# EAGLE design 5v-low-power (EAGLE 6.5.0)
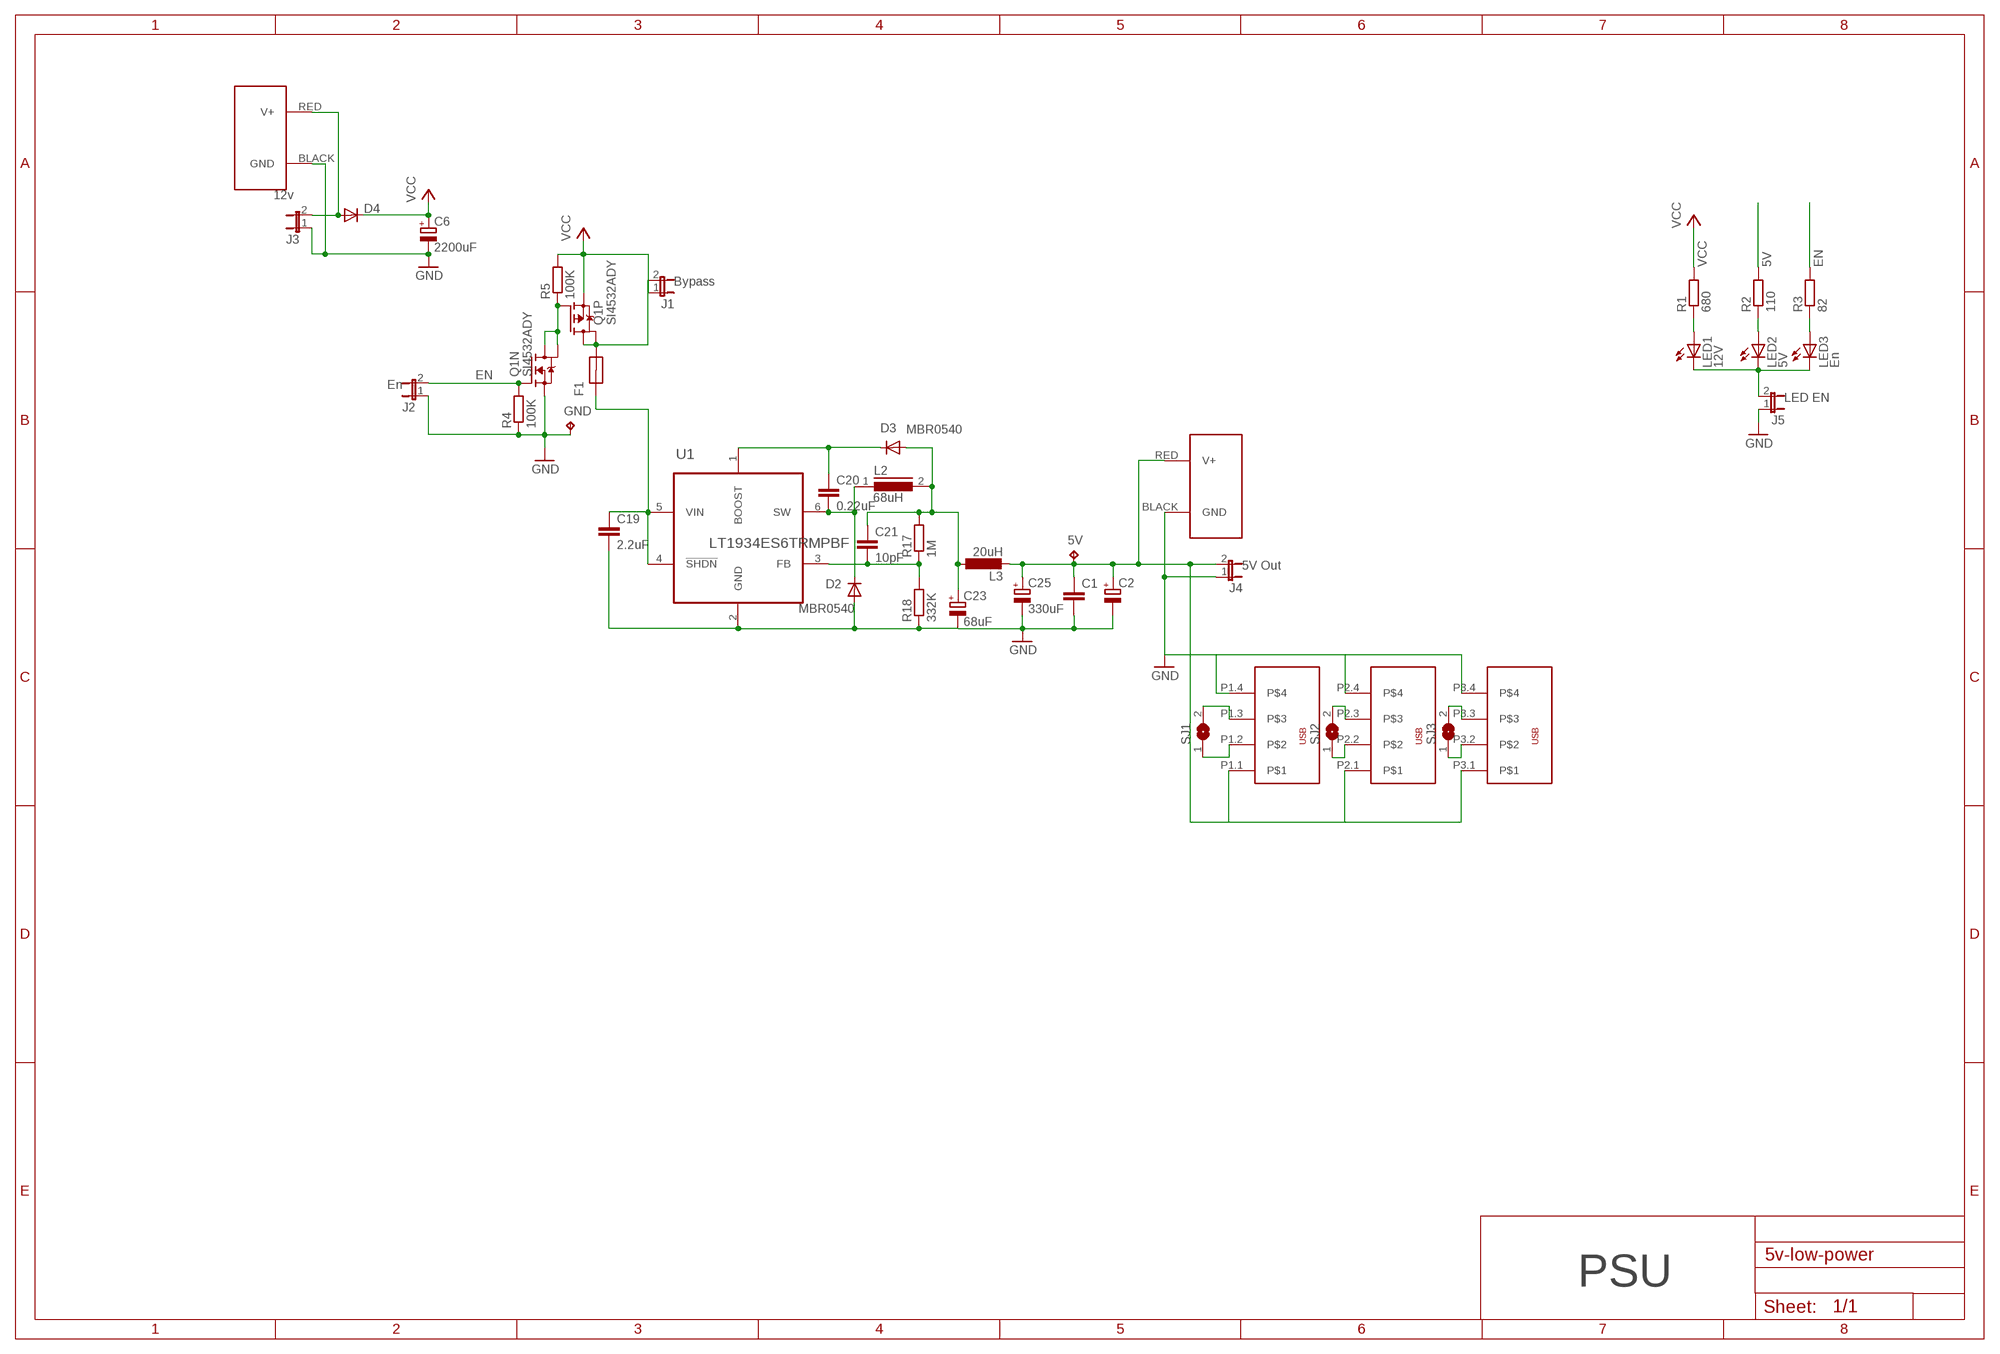
[diagram p0: schematic, sheet 1]

## Parts
5V  5V B  TPB1,27  [B1,27]
C1  C-EUC0805  [C0805]
C2  CPOL-EUB/3528-21R  [B/3528-21R]
C6  2200uF  CPOL-EUE5-13  [E5-13]
C19  2.2uF  C-EUC0805  [C0805]
C20  0.22uF  C-EUC0805  [C0805]
C21  10pF  C-EUC0805  [C0805]
C23  68uF  CPOL-EUE  [PANASONIC_E]
C25  330uF  CPOL-EUE5-8.5  [E5-8,5]
D2  MBR0540  MBR0520LT  [SOD123]
D3  MBR0540  MBR0520LT  [SOD123]
D4  DIODE-SMB  [SMB]
F1  MF-MSMF110  [1812]
GND  5V B  TPB1,27  [B1,27]
J1  Bypass  2-PIN-MOLEX  [2-MOLEX]
J2  En  2-PIN-MOLEX  [2-MOLEX]
J3  12v  2-PIN-MOLEX  [2-MOLEX]
J4  5V Out  2-PIN-MOLEX  [2-MOLEX]
J5  LED EN  2-PIN-MOLEX  [2-MOLEX]
J6  POWERPOLE_POWER25A  [POWERPOLE_PAIR_25A]
J7  POWERPOLE_POWER25A  [POWERPOLE_PAIR_25A]
L2  68uH  DR127  [DR127]
L3  20uH  L-EU6000-XXX-RC  [6000-XXXX-RC]
LED1  12V  LEDCHIP-LED0805  [CHIP-LED0805]
LED2  5V  LEDCHIP-LED0805  [CHIP-LED0805]
LED3  En  LEDCHIP-LED0805  [CHIP-LED0805]
Q1  SI4532ADY  [SO8]
R1  680  R-EU_R0805  [R0805]
R2  110  R-EU_R0805  [R0805]
R3  82  R-EU_R0805  [R0805]
R4  100K  R-EU_R0805  [R0805]
R5  100K  R-EU_R0805  [R0805]
R17  1M  R-EU_R0805  [R0805]
R18  332K  R-EU_R0805  [R0805]
SJ1  SJ  [SJ]
SJ2  SJ  [SJ]
SJ3  SJ  [SJ]
U1  LT1934ES6TRMPBF  [SOT95P280X100-6N]
U$1  USB_DUAL_VERT+HORIZTRIPPLE  [USB_DUAL_HORIZ+VERT]

## Nets
5V: 5V.TP C1.1 C2.+ C25.+ J4.2 J6.RED(V+) L3.2 R2.2 U$1.P1.1 U$1.P2.1 U$1.P3.1
EN: J2.2 Q1.2(N:G) R3.2 R4.2
GND: C1.2 C2.- C6.- C19.2 C23.- C25.- D2.A GND.TP J2.1 J3.1 J4.1 J5.1 J6.BLACK(GND) J7.BLACK(GND) Q1.1(N:S) R4.1 R18.1 U1.2(GND) U$1.P1.4 U$1.P2.4 U$1.P3.4
LEDGND1: J5.2 LED1.C LED2.C LED3.C
N$1: LED1.A R1.1
N$2: SJ1.2 U$1.P1.3
N$3: D4.A J3.2 J7.RED(V+)
N$4: SJ1.1 U$1.P1.2
N$5: SJ2.1 U$1.P2.2
N$6: SJ2.2 U$1.P2.3
N$7: SJ3.2 U$1.P3.3
N$8: SJ3.1 U$1.P3.2
N$25: Q1.4(P:G) Q1.7(N:D) Q1.8(N:D) R5.1
N$47: LED2.A R2.1
N$74: LED3.A R3.1
N$78: C20.2 D2.C L2.1 U1.6(SW)
N$95: F1.2 J1.2 Q1.5(P:D) Q1.6(P:D)
N$107: C21.1 C23.+ D3.A L2.2 L3.1 R17.2
N$117: C20.1 D3.C U1.1(BOOST)
N$118: C21.2 R17.1 R18.2 U1.3(FB)
VCC: C6.+ D4.C J1.1 Q1.3(P:S) R1.2 R5.2
VCC_HP2_SW: C19.1 F1.1 U1.4(!SHDN) U1.5(VIN)

## Notes on the sheet
- PSU

## Library data of the parts
5V GND = testpad:TP: Test pad
C1 C19-C21 = resistor:C-EU: CAPACITOR, European symbol
C2 = resistor:CPOL-EU: POLARIZED CAPACITOR, European symbol
C6 C23 C25 = rcl:CPOL-EU: POLARIZED CAPACITOR, European symbol
D2 D3 = diode:MBR0520LT: SCHOTTKY BARRIER RECTIFIER Source: http://onsemi.com .. MBR0520LT1-D.pdf
D4 = diode:DIODE-: DIODE
F1 = farnell-parts:MF-MSMF110
J1-J5 = farnell-parts:2-PIN-MOLEX
J6 J7 = powerpoles:POWERPOLE_POWER: Anderson Powerpole Power Connector using ameteur radio standard layout
L2 = inductors:DR127: High Power Density, High Efficiency, Shielded Inductors Source: coiltronics_dr_series.pdf
L3 = rcl:L-EU: INDUCTOR, European symbol
LED1-LED3 = led:LED: LED OSRAM: - CHIPLED LG R971, LG N971, LY N971, LG Q971, LY Q971, LO R971, LY R971 LH N974, LH R974 LS Q976, LO Q976, LY Q976 LO Q996 - Hyper CHIPLED LW Q18S LB Q993, LB Q99A, LB R99A - SideLED LS A670, LO A670, LY A670, LG A670, LP A670 LB A673, LV A673, LT A673, LW A673 LH A674 LY A675 LS A676, LA A676, LO A676, LY A676, LW A676 LS A679, LY A679, LG A679 - Hyper Micro SIDELED® LS Y876, LA Y876, LO Y876, LY Y876 LT Y87S - SmartLED LW L88C, LW L88S LB L89C, LB L89S, LG L890 LS L89K, LO L89K, LY L89K LS L896, LA L896, LO L896, LY L896 - TOPLED LS T670, LO T670, LY T670, LG T670, LP T670 LSG T670, LSP T670, LSY T670, LOP T670, LYG T670 LG T671, LOG T671, LSG T671 LB T673, LV T673, LT T673, LW T673 LH T674 LS T676, LA T676, LO T676, LY T676, LB T676, LH T676, LSB T676, LW T676 LB T67C, LV T67C, LT T67C, LS T67K, LO T67K, LY T67K, LW E67C LS E67B, LA E67B, LO E67B, LY E67B, LB E67C, LV E67C, LT E67C LW T67C LS T679, LY T679, LG T679 LS T770, LO T770, LY T770, LG T770, LP T770 LB T773, LV T773, LT T773, LW T773 LH T774 LS E675, LA E675, LY E675, LS T675 LS T776, LA T776, LO T776, LY T776, LB T776 LHGB T686 LT T68C, LB T68C - Hyper Mini TOPLED® LB M676 - Mini TOPLED Santana® LG M470 LS M47K, LO M47K, LY M47K Source: http://www.osram.convergy.de LUXEON: - LUMILED® LXK2-PW12-R00, LXK2-PW12-S00, LXK2-PW14-U00, LXK2-PW14-V00 LXK2-PM12-R00, LXK2-PM12-S00, LXK2-PM14-U00 LXK2-PE12-Q00, LXK2-PE12-R00, LXK2-PE12-S00, LXK2-PE14-T00, LXK2-PE14-U00 LXK2-PB12-K00, LXK2-PB12-L00, LXK2-PB12-M00, LXK2-PB14-N00, LXK2-PB14-P00, LXK2-PB14-Q00 LXK2-PR12-L00, LXK2-PR12-M00, LXK2-PR14-Q00, LXK2-PR14-R00 LXK2-PD12-Q00, LXK2-PD12-R00, LXK2-PD12-S00 LXK2-PH12-R00, LXK2-PH12-S00 LXK2-PL12-P00, LXK2-PL12-Q00, LXK2-PL12-R00 Source: www.luxeon.com KINGBRIGHT: KA-3528ASYC Source: www.kingbright.com
Q1 = basestation:SI4532ADY: N and P MOSFETS
R1-R5 R17 R18 = resistor:R-EU_: RESISTOR, European symbol
SJ1-SJ3 = jumper:SJ: SMD solder JUMPER
U1 = farnell-parts:LT1934ES6TRMPBF; DESCRIPTION: Micropower Step-Down Switching Regulators; MPN: LT1934ES6#TRMPBF; OC_FARNELL: 1663810; OC_NEWARK: 59M8316; PACKAGE: TSOT-23-6; SUPPLIER: Linear Technology
U$1 = power:USB_DUAL_VERT+HORIZ

## Board
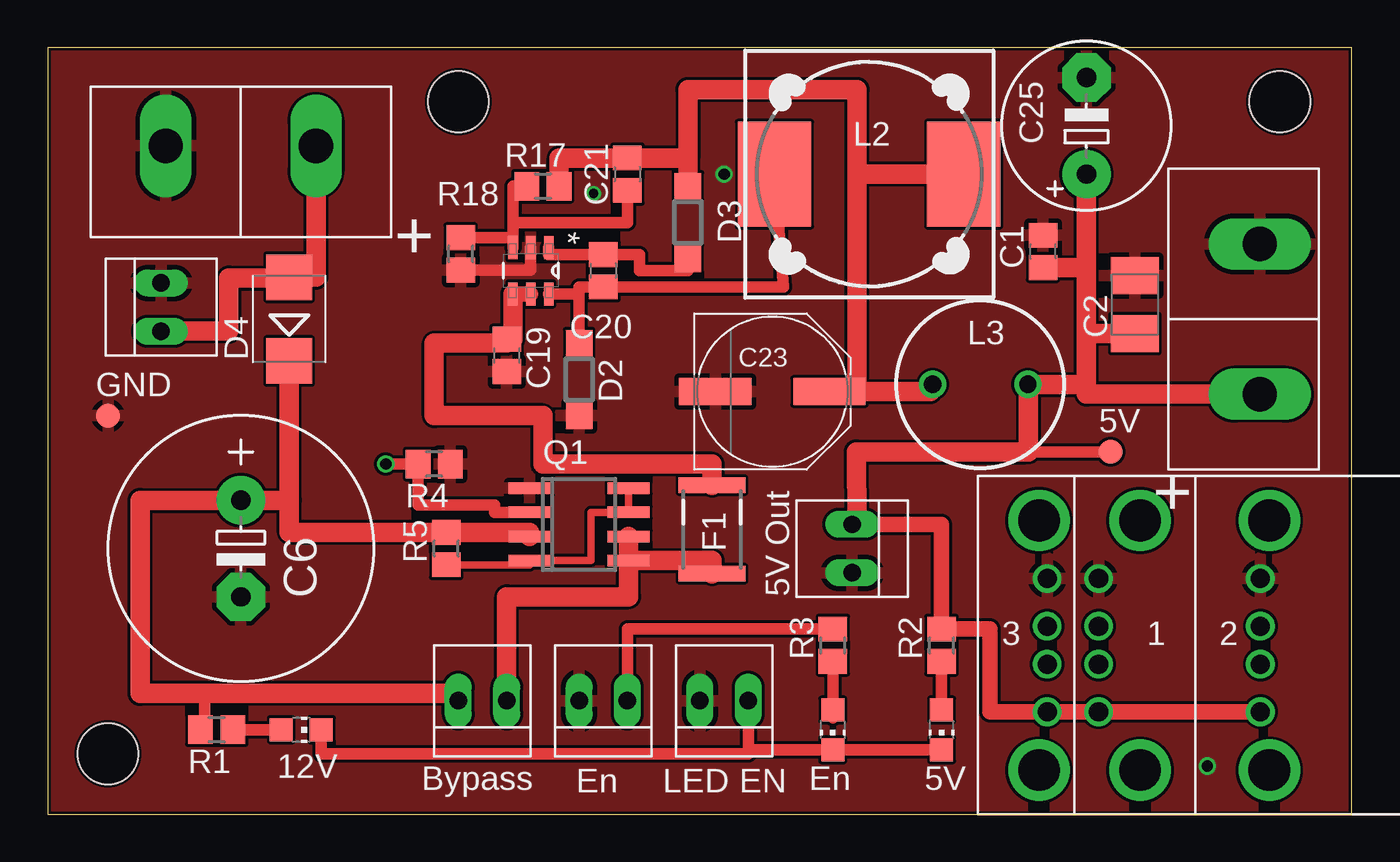
[diagram p1: board, top side]
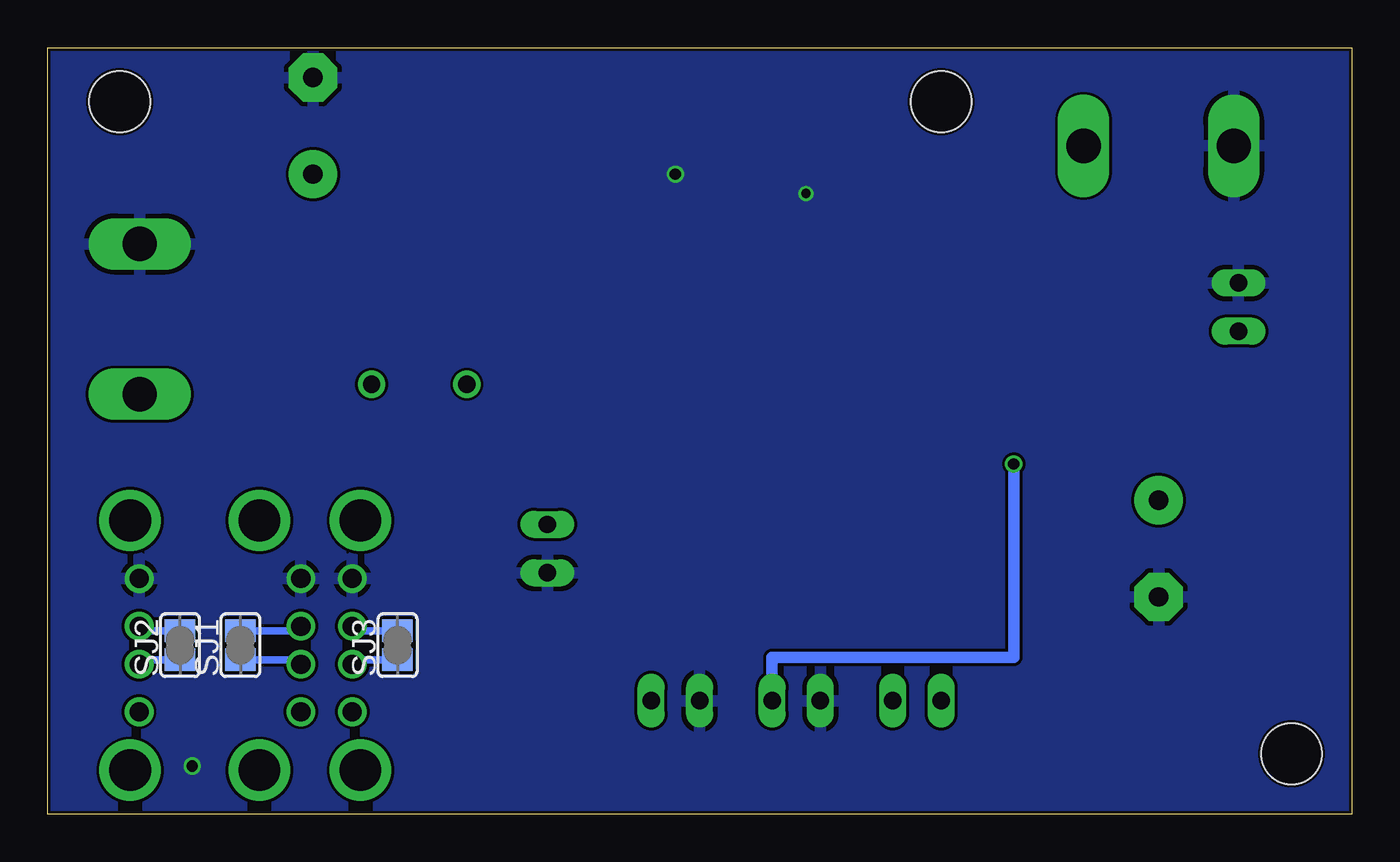
[diagram p2: board, bottom side, seen from below]

Size 68.56 x 40.31 mm. Coordinates in mm from the lower left corner, seen from the top.
Outline: 0,0 68.56,0 68.56,40.31 0,40.31 0,0
Copper layers (1*16): Top 0.035mm / dielectric 1.5mm / Bottom 0.035mm
Design rules "Hackvana *": minimum track width 6mil, minimum drill 0.3mm, track to track 6mil, track to pad 6mil, pad to pad 6mil, via to via 6mil, smd to smd 0mil, copper to edge 6mil, drill to drill 6mil, minimum pad ring 10mil, minimum via ring 6mil, stop-mask expansion 2mil, vias tented up to drill 100mil, thermal gap 10mil
Holes 3.2 mm at 64.77,37.47 21.59,37.47 3.17,3.17

### Footprints (pad centres in the part's own frame; a part is rotated, then mirrored left to right if it is on the bottom)
B1,27 = smd 1.27 x 1.27: TP 0,0
C0805 = smd 1.3 x 1.5: 1 -0.85,0; 2 0.85,0
B/3528-21R = smd 1.95 x 2.5: + 1.525,0; - -1.525,0
E5-13 = drill 1.016 pad 2.54: + -2.54,0 | drill 1.016 pad 2.54 octagon: - 2.54,0
PANASONIC_E = smd 3.8 x 1.4: + 3,0; - -3,0
E5-8,5 = drill 1.016 pad 2.54: + -2.54,0 | drill 1.016 pad 2.54 octagon: - 2.54,0
SOD123 = smd 1.4 x 1.4: A 1.9,0; C -1.9,0
SMB = smd 2.4 x 2.4: A 2.2,0; C -2.2,0
1812 = smd 0.8 x 3.5: 1 -1.425,0; 2 3.225,0
2-MOLEX = drill 0.914 long: 1 -1.27,-0.381; 2 1.27,-0.381
POWERPOLE_PAIR_25A = drill 1.8 long: BLACK 3.95,-0.85; RED -3.95,-0.85
DR127 = smd 3.85 x 5.5: 1 -4.975,0; 2 4.975,0
6000-XXXX-RC = drill 0.9 pad 1.422: 1 -2.5,0; 2 2.5,0
CHIP-LED0805 = smd 1.2 x 1.2: A 0,-1.05; C 0,1.05
SO8 = smd 0.6 x 2.2: 1 -1.905,-2.6; 2 -0.635,-2.6; 3 0.635,-2.6; 4 1.905,-2.6; 5 1.905,2.6; 6 0.635,2.6; 7 -0.635,2.6; 8 -1.905,2.6
R0805 = smd 1.3 x 1.5: 1 -0.85,0; 2 0.85,0
SJ = smd 1.168 x 1.6: 1 -0.762,0; 2 0.762,0
SOT95P280X100-6N = smd 1.219 x 0.508: 1 -1.219,0.94; 2 -1.219,0; 3 -1.219,-0.94; 4 1.219,-0.94; 5 1.219,0; 6 1.219,0.94
USB_DUAL_HORIZ+VERT = drill 2.2: G1.1 2.18,-6.565; G1.2 2.18,6.565; G2.1 8.98,-6.565; G2.2 8.98,6.565; G3.1 -3.13,-6.565; G3.2 -3.13,6.565 | drill 1: P1.1 0,-3.5; P1.2 0,-1; P1.3 0,1; P1.4 0,3.5; P2.1 8.5,-3.5; P2.2 8.5,-1; P2.3 8.5,1; P2.4 8.5,3.5; P3.1 -2.7,-3.5; P3.2 -2.7,-1; P3.3 -2.7,1; P3.4 -2.7,3.5

### Placement (x,y rotation side)
5V  55.88,19.05 0 top
C1  52.32,29.59 90 top
C2  57.15,26.8 270 top
C6  10.16,13.97 270 top
C19  24.13,24.13 270 top
C20  29.21,28.57 270 top
C21  30.48,33.66 270 top
C23  38.1,22.23 0 top
C25  54.61,36.2 90 top
D2  27.94,22.86 270 top
D3  33.66,31.11 90 top
D4  12.7,26.04 90 top
F1  34.92,15.88 270 top
GND  3.17,20.95 0 top
J1  22.86,6.35 0 top
J2  29.21,6.35 0 top
J3  6.35,26.67 270 top
J4  41.91,13.97 90 top
J5  35.56,6.35 0 top
J6  62.87,26.04 90 top
J7  10.16,34.29 180 top
L2  43.18,33.66 0 top
L3  49.02,22.61 0 top
LED1  13.34,4.45 270 top
LED2  46.99,4.45 180 top
LED3  41.27,4.45 180 top
Q1  27.94,15.24 270 top
R1  8.89,4.45 180 top
R2  46.99,8.89 90 top
R3  41.27,8.89 90 top
R4  20.32,18.41 180 top
R5  20.95,13.97 90 top
R17  26.04,33.02 0 top
R18  21.72,29.46 90 top
SJ1  58.42,8.89 90 bottom
SJ2  61.59,8.89 90 bottom
SJ3  50.16,8.89 90 bottom
U1  25.4,28.57 270 top
U$1  55.24,8.89 0 top

### Tracks (layer width: path | path; a pad name or v marks a point on that pad's centre or on a via)
5V
  Top 0.61: 49.53,9.74 49.53,9.53 | 5V.TP 51.56,19.05 51.4,19.05
  Top 0.813: 49.53,9.74 R2.2 46.99,15.24 42.55,15.24 | U$1.P2.1 U$1.P1.1 U$1.P3.1 49.53,5.39 49.53,9.53
  Top 1.016: 54.61,22.61 54.61,25.27 | 54.61,25.27 54.61,28.96 | 54.61,28.96 C25.+ | J4.2 42.55,15.24 42.51,19.05 51.4,19.05 | C2.+ 54.61,25.27 | C1.1 54.4,28.74 54.61,28.96 | L3.2 51.56,22.61 | 51.56,22.61 54.61,22.61 | J6.RED 54.61,22.09 54.61,22.61 | 51.56,22.61 51.56,19.05
EN  (via drill 0.6)
  Top 0.61: Q1.2 23.5,15.88 23.5,16.26 19.47,16.26 R4.2 v17.78,18.41 | R3.2 30.48,9.74 J2.2
  Bottom 0.61: v17.78,18.41 17.78,8.26 30.48,8.26 J2.2
GND  (via drill 0.48, 0.6)
  Top 0.61: R18.1 25.4,28.61 U1.2
  other vias: 35.56,33.66 60.96,2.54 28.7,32.64
  pour Bottom: -8.26,55.88 83.19,51.44 80.64,-5.08 -6.99,-5.08
  pour Top: -3.17,48.9 73.66,48.9 73.03,-2.54 -4.45,-2.54
LEDGND1
  Top 0.61: LED1.C 14.38,3.17 36.83,3.17 36.83,3.4 | 36.83,3.4 J5.2 | 36.83,3.4 LED3.C LED2.C
N$1
  Top 0.61: R1.1 LED1.A
N$2
  Bottom 0.406: SJ1.2 55.24,9.65 U$1.P1.3
N$3
  Top 1.016: J7.RED 14.11,28.23 D4.A 12.7,28.19 9.53,28.19 9.53,25.4 J3.2
N$4
  Bottom 0.406: SJ1.1 55.24,8.13 U$1.P1.2
N$5
  Bottom 0.406: SJ2.1 63.74,8.13 U$1.P2.2
N$6
  Bottom 0.406: SJ2.2 63.74,9.65 U$1.P2.3
N$7
  Bottom 0.406: SJ3.2 52.55,9.65 U$1.P3.3
N$8
  Bottom 0.406: SJ3.1 52.55,8.13 U$1.P3.2
N$25
  Top 0.406: R5.1 25.34,13.12 Q1.4 28.57,13.34 28.57,15.88 Q1.7 Q1.8
N$47
  Top 0.61: LED2.A R2.1
N$74
  Top 0.61: 41.27,5.08 LED3.A R3.1
N$78
  Top 0.61: U1.6 27.94,27.36 | 27.94,27.36 D2.C | 27.94,27.36 27.94,27.73 C20.2 38.68,27.73 L2.1
N$95
  Top 1.016: J1.2 24.13,11.43 30.54,11.43 Q1.5 | Q1.5 Q1.6 | Q1.5 34.92,13.34 F1.2
N$107
  Top 1.016: R17.2 26.89,34.51 C21.1 33.66,34.51 | D3.A 33.66,34.51 | 42.55,22.23 42.55,33.66 | 42.55,33.66 42.55,38.1 33.66,38.1 33.66,34.51 | L2.2 42.55,33.66 | C23.+ 42.55,22.23 | 42.55,22.23 46.4,22.23 L3.1
N$117
  Top 0.61: U1.1 26.34,29.43 C20.1 31.11,29.43 31.11,28.57 33.65,28.57 D3.C
N$118
  Top 0.61: R18.2 24.46,30.31 | 24.46,30.31 U1.3 | R17.1 24.46,33.02 24.46,31.11 | 24.46,31.11 24.46,30.31 | C21.2 30.48,31.11 24.46,31.11
VCC
  Top 0.406: 20.95,14.61 R5.2
  Top 0.61: J1.1 21.59,6.35 | R1.2 8.26,4.45 8.26,6.35
  Top 1.016: 12.7,16.51 C6.+ 4.87,16.51 4.87,6.35 8.26,6.35 21.59,6.35 | 12.7,16.51 D4.C | Q1.3 25.34,14.82 R5.2 12.7,14.82 12.7,16.51
VCC_HP2_SW
  Top 0.61: C19.1 24.46,24.98
  Top 0.813: U1.4 U1.5
  Top 1.016: F1.1 34.92,18.41 26.04,18.41 26.04,20.95 20.32,20.95 20.32,24.77 24.13,24.77 C19.1 | 24.46,24.98 U1.4

### Text on the board
tDocu: 5V Low Power | PJB | V0.3 | 250mA